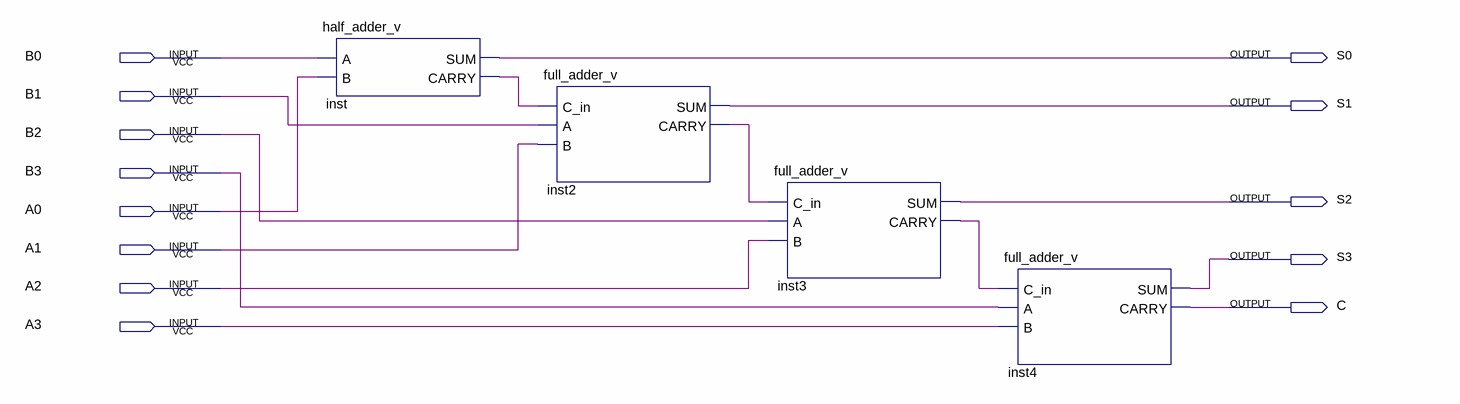
[diagram p0: schematic sheet]
// Quartus schematic 4bit_rc_adder.bdf as structural Verilog: 4 symbols, 13 pins
module \4bit_rc_adder  (
  input  B0,
  input  B1,
  input  B2,
  input  B3,
  input  A0,
  input  A1,
  input  A2,
  input  A3,
  output S0,
  output S1,
  output S2,
  output S3,
  output C
);

  wire inst2_carry, inst3_carry, inst_carry;

  half_adder_v inst (.A(B0), .B(A0), .SUM(S0), .CARRY(inst_carry));
  full_adder_v inst2 (.C_in(inst_carry), .A(B1), .B(A1), .SUM(S1), .CARRY(inst2_carry));
  full_adder_v inst3 (.C_in(inst2_carry), .A(B2), .B(A2), .SUM(S2), .CARRY(inst3_carry));
  full_adder_v inst4 (.C_in(inst3_carry), .A(B3), .B(A3), .SUM(S3), .CARRY(C));
endmodule
